# Altium schematic sheet 14 Exp Conn.SchDoc
size 420 x 297 mm
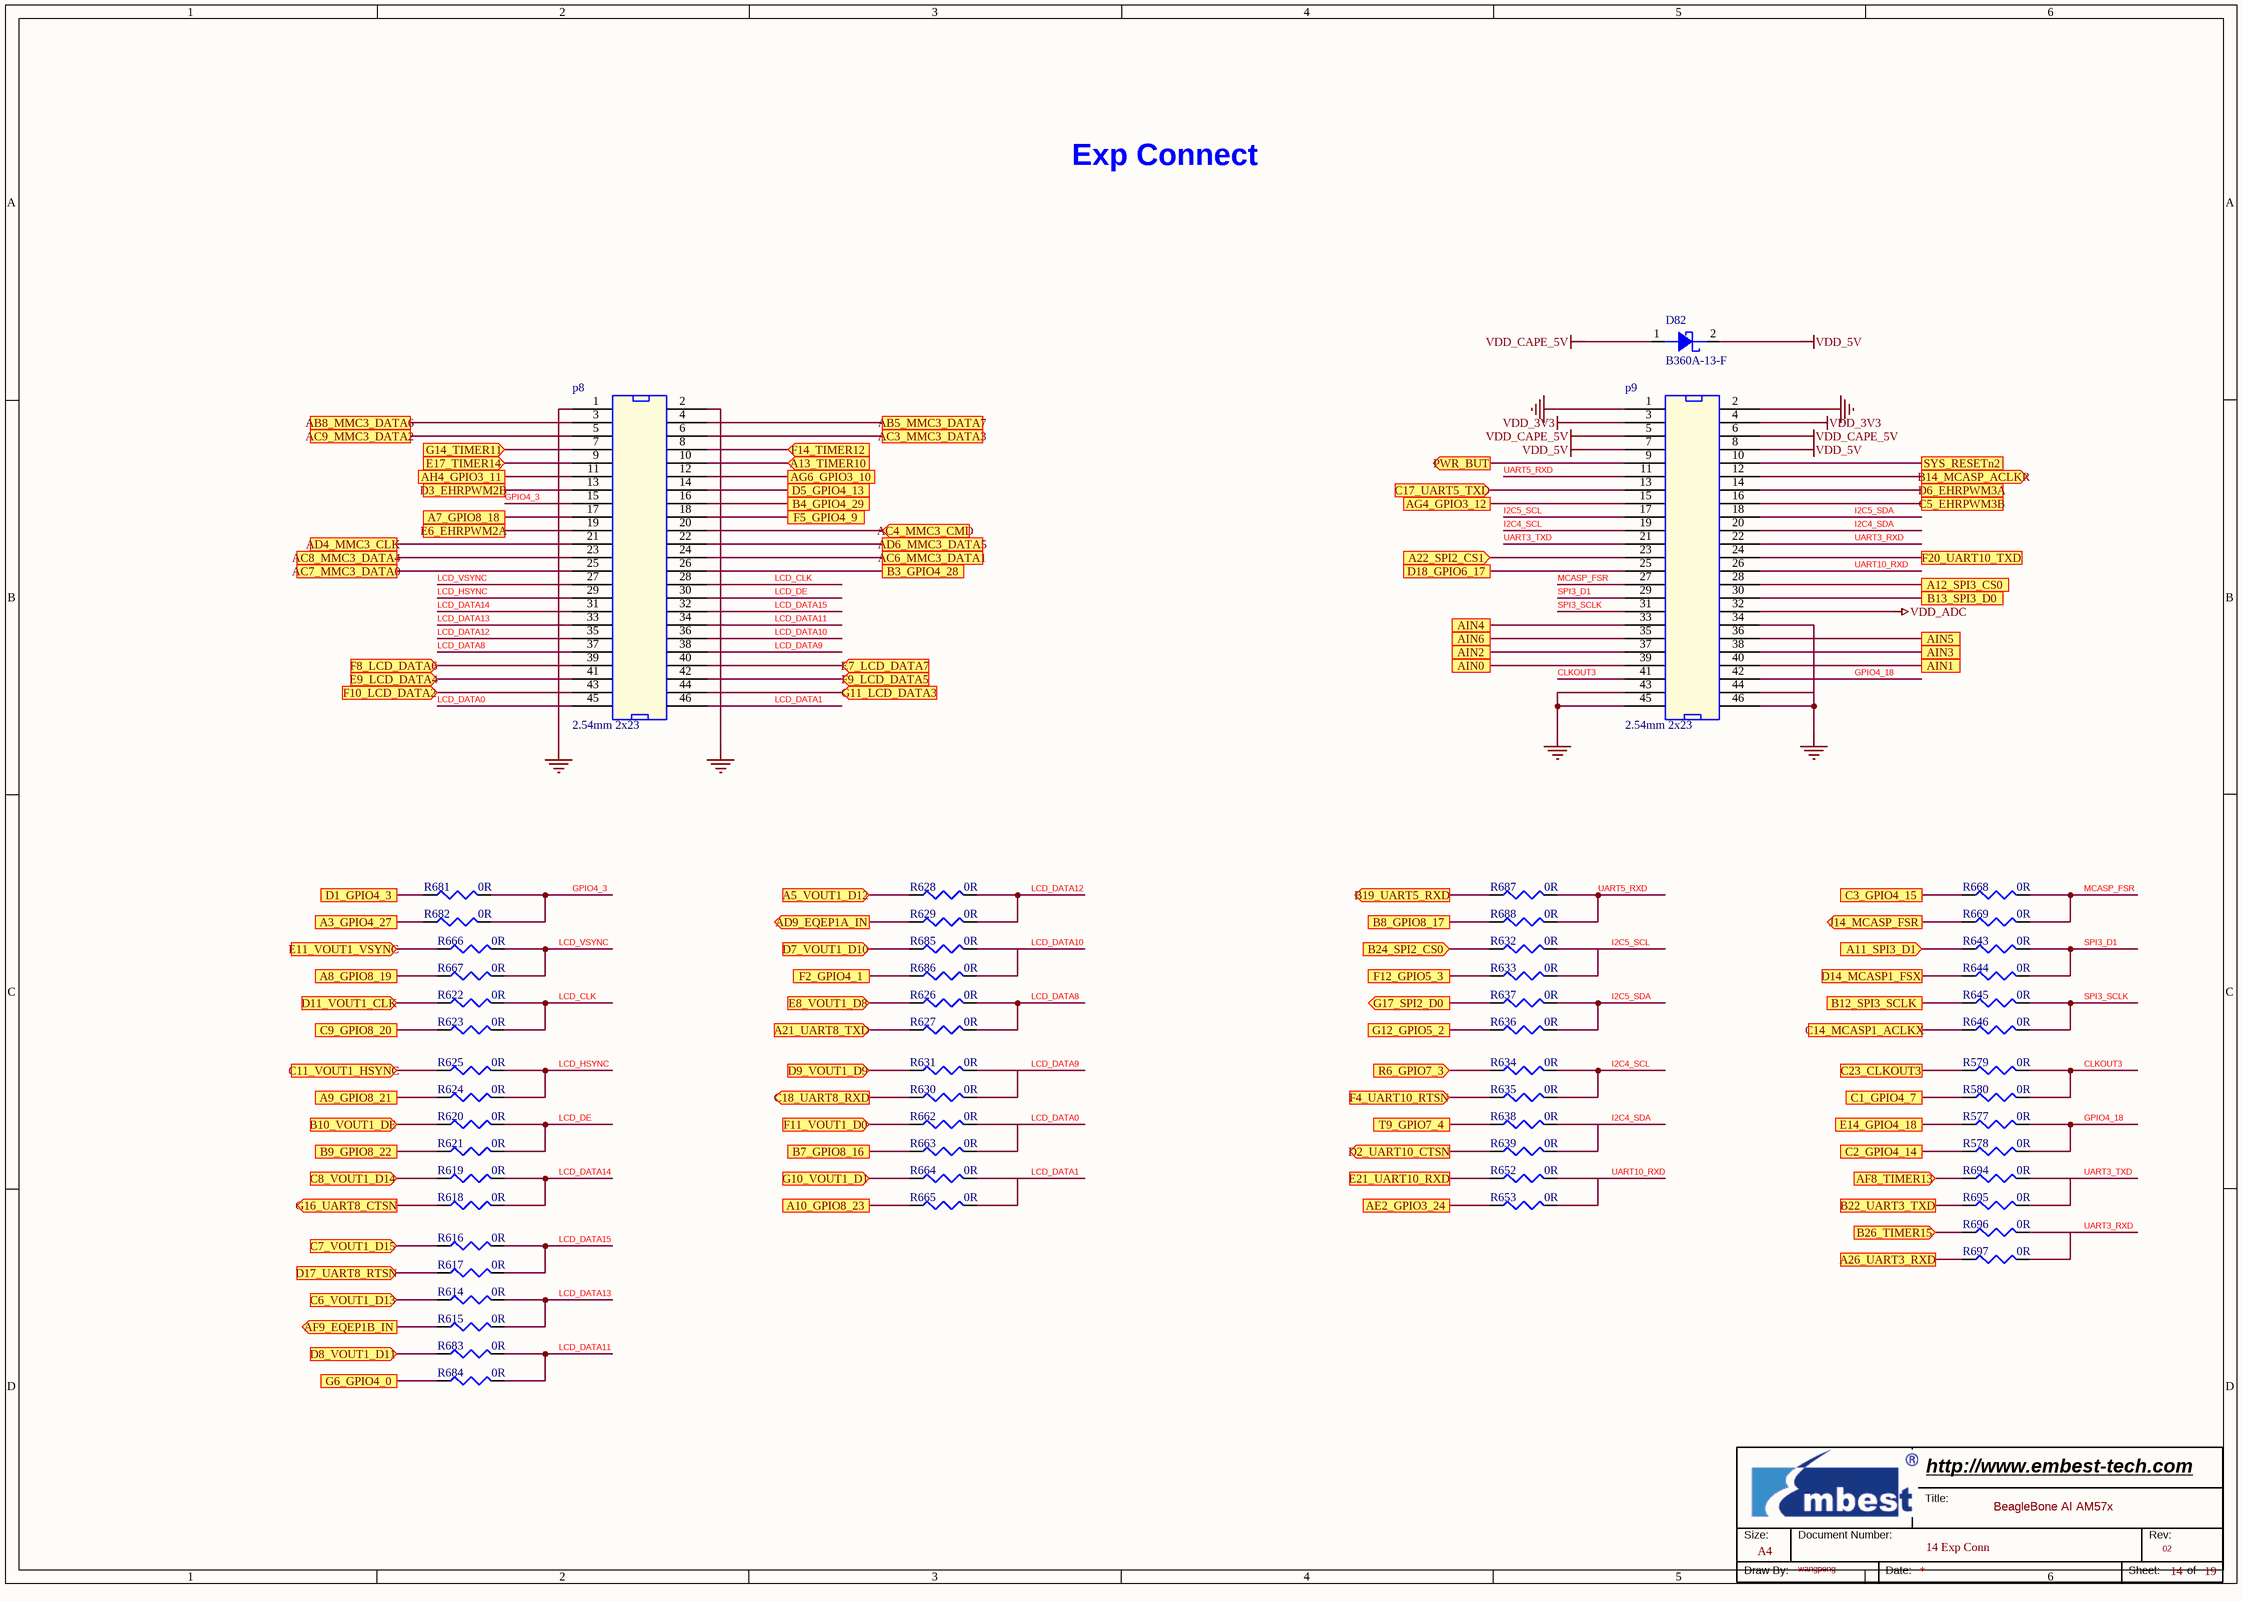
[diagram p0: 14 Exp Conn.SchDoc]

## Parts
*  Page Count: 19  Page Number: 14  Page Size: A4  Title: BeagleBone AI AM57x  RevCode: 02  Doc: 14 Exp Conn  Drawing: wangpeng  (hidden comment: Embest Title)  (graphical)
D82  B360A-13-F  [D_SMA]
p8  2.54mm 2x23  [h2x23mz]
p9  2.54mm 2x23  [h2x23mz]
R577  0R  [R0402]
R578  0R  [R0402]
R579  0R  [R0402]
R580  0R  [R0402]
R614  0R  [R0402]
R615  0R  [R0402]
R616  0R  [R0402]
R617  0R  [R0402]
R618  0R  [R0402]
R619  0R  [R0402]
R620  0R  [R0402]
R621  0R  [R0402]
R622  0R  [R0402]
R623  0R  [R0402]
R624  0R  [R0402]
R625  0R  [R0402]
R626  0R  [R0402]
R627  0R  [R0402]
R628  0R  [R0402]
R629  0R  [R0402]
R630  0R  [R0402]
R631  0R  [R0402]
R632  0R  [R0402]
R633  0R  [R0402]
R634  0R  [R0402]
R635  0R  [R0402]
R636  0R  [R0402]
R637  0R  [R0402]
R638  0R  [R0402]
R639  0R  [R0402]
R643  0R  [R0402]
R644  0R  [R0402]
R645  0R  [R0402]
R646  0R  [R0402]
R652  0R  [R0402]
R653  0R  [R0402]
R662  0R  [R0402]
R663  0R  [R0402]
R664  0R  [R0402]
R665  0R  [R0402]
R666  0R  [R0402]
R667  0R  [R0402]
R668  0R  [R0402]
R669  0R  [R0402]
R681  0R  [R0402]
R682  0R  [R0402]
R683  0R  [R0402]
R684  0R  [R0402]
R685  0R  [R0402]
R686  0R  [R0402]
R687  0R  [R0402]
R688  0R  [R0402]
R694  0R  [R0402]
R695  0R  [R0402]
R696  0R  [R0402]
R697  0R  [R0402]

## Ports
A3_GPIO4_27, A5_VOUT1_D12 (in), A7_GPIO8_18, A8_GPIO8_19, A9_GPIO8_21, A10_GPIO8_23, A11_SPI3_D1 (in), A12_SPI3_CS0, A13_TIMER10 (in), A21_UART8_TXD (in), A22_SPI2_CS1 (in), A26_UART3_RXD, AB5_MMC3_DATA7, AB8_MMC3_DATA6, AC3_MMC3_DATA3, AC4_MMC3_CMD (in), AC6_MMC3_DATA1, AC7_MMC3_DATA0, AC8_MMC3_DATA4, AC9_MMC3_DATA2, AD4_MMC3_CLK, AD6_MMC3_DATA5, AD9_EQEP1A_IN (out), AE2_GPIO3_24, AF8_TIMER13 (in), AF9_EQEP1B_IN (out), AG4_GPIO3_12, AG6_GPIO3_10, AH4_GPIO3_11, AIN0, AIN1, AIN2, AIN3, AIN4, AIN5, AIN6, B3_GPIO4_28, B4_GPIO4_29, B7_GPIO8_16, B8_GPIO8_17, B9_GPIO8_22, B10_VOUT1_DE (in), B12_SPI3_SCLK, B13_SPI3_D0, B14_MCASP_ACLKR (out), B19_UART5_RXD (out), B22_UART3_TXD, B24_SPI2_CS0 (in), B26_TIMER15 (in), C1_GPIO4_7, C2_GPIO4_14, C3_GPIO4_15, C5_EHRPWM3B, C6_VOUT1_D13 (in), C7_VOUT1_D15 (in), C8_VOUT1_D14 (in), C9_GPIO8_20, C11_VOUT1_HSYNC (in), C14_MCASP1_ACLKX, C17_UART5_TXD (in), C18_UART8_RXD (out), C23_CLKOUT3, D1_GPIO4_3, D2_UART10_CTSN (out), D3_EHRPWM2B, D5_GPIO4_13, D6_EHRPWM3A, D7_VOUT1_D10 (in), D8_VOUT1_D11 (in), D9_VOUT1_D9 (in), D11_VOUT1_CLK (in), D14_MCASP1_FSX, D17_UART8_RTSN (in), D18_GPIO6_17, E6_EHRPWM2A, E7_LCD_DATA7 (in), E8_VOUT1_D8 (in), E9_LCD_DATA4 (in), E11_VOUT1_VSYNC (in), E14_GPIO4_18, E17_TIMER14 (in), E21_UART10_RXD, F2_GPIO4_1, F4_UART10_RTSN (in), F5_GPIO4_9, F8_LCD_DATA6 (in), F9_LCD_DATA5 (in), F10_LCD_DATA2 (in), F11_VOUT1_D0 (in), F12_GPIO5_3, F14_TIMER12 (in), F20_UART10_TXD, G6_GPIO4_0, G10_VOUT1_D1 (in), G11_LCD_DATA3 (in), G12_GPIO5_2, G14_TIMER11 (in), G16_UART8_CTSN (out), G17_SPI2_D0 (out), J14_MCASP_FSR (out), PWR_BUT (out), R6_GPIO7_3 (in), SYS_RESETn2, T9_GPIO7_4

## Nets
GND: p8.1 p8.2 p9.1 p9.2 p9.34 p9.43 p9.44 p9.45 p9.46
VDD_3V3: p9.3 p9.4
VDD_5V: D82.2(C) p9.7 p9.8
VDD_ADC: p9.32
VDD_CAPE_5V: D82.1(A) p9.5 p9.6
A3_GPIO4_27: R682.1 ; port A3_GPIO4_27
A5_VOUT1_D12: R628.1 ; port A5_VOUT1_D12
A7_GPIO8_18: p8.17 ; port A7_GPIO8_18
A8_GPIO8_19: R667.1 ; port A8_GPIO8_19
A9_GPIO8_21: R624.2 ; port A9_GPIO8_21
A10_GPIO8_23: R665.1 ; port A10_GPIO8_23
A11_SPI3_D1: R643.1 ; port A11_SPI3_D1
A12_SPI3_CS0: p9.28 ; port A12_SPI3_CS0
A13_TIMER10: p8.10 ; port A13_TIMER10
A21_UART8_TXD: R627.1 ; port A21_UART8_TXD
A22_SPI2_CS1: p9.23 ; port A22_SPI2_CS1
A26_UART3_RXD: R697.1 ; port A26_UART3_RXD
AB5_MMC3_DATA7: p8.4 ; port AB5_MMC3_DATA7
AB8_MMC3_DATA6: p8.3 ; port AB8_MMC3_DATA6
AC3_MMC3_DATA3: p8.6 ; port AC3_MMC3_DATA3
AC4_MMC3_CMD: p8.20 ; port AC4_MMC3_CMD
AC6_MMC3_DATA1: p8.24 ; port AC6_MMC3_DATA1
AC7_MMC3_DATA0: p8.25 ; port AC7_MMC3_DATA0
AC8_MMC3_DATA4: p8.23 ; port AC8_MMC3_DATA4
AC9_MMC3_DATA2: p8.5 ; port AC9_MMC3_DATA2
AD4_MMC3_CLK: p8.21 ; port AD4_MMC3_CLK
AD6_MMC3_DATA5: p8.22 ; port AD6_MMC3_DATA5
AD9_EQEP1A_IN: R629.1 ; port AD9_EQEP1A_IN
AE2_GPIO3_24: R653.1 ; port AE2_GPIO3_24
AF8_TIMER13: R694.1 ; port AF8_TIMER13
AF9_EQEP1B_IN: R615.1 ; port AF9_EQEP1B_IN
AG4_GPIO3_12: p9.15 ; port AG4_GPIO3_12
AG6_GPIO3_10: p8.12 ; port AG6_GPIO3_10
AH4_GPIO3_11: p8.11 ; port AH4_GPIO3_11
AIN0: p9.39 ; port AIN0
AIN1: p9.40 ; port AIN1
AIN2: p9.37 ; port AIN2
AIN3: p9.38 ; port AIN3
AIN4: p9.33 ; port AIN4
AIN5: p9.36 ; port AIN5
AIN6: p9.35 ; port AIN6
B3_GPIO4_28: p8.26 ; port B3_GPIO4_28
B4_GPIO4_29: p8.16 ; port B4_GPIO4_29
B7_GPIO8_16: R663.1 ; port B7_GPIO8_16
B8_GPIO8_17: R688.1 ; port B8_GPIO8_17
B9_GPIO8_22: R621.1 ; port B9_GPIO8_22
B10_VOUT1_DE: R620.1 ; port B10_VOUT1_DE
B12_SPI3_SCLK: R645.1 ; port B12_SPI3_SCLK
B13_SPI3_D0: p9.30 ; port B13_SPI3_D0
B14_MCASP_ACLKR: p9.12 ; port B14_MCASP_ACLKR
B19_UART5_RXD: R687.1 ; port B19_UART5_RXD
B22_UART3_TXD: R695.1 ; port B22_UART3_TXD
B24_SPI2_CS0: R632.1 ; port B24_SPI2_CS0
B26_TIMER15: R696.1 ; port B26_TIMER15
C1_GPIO4_7: R580.2 ; port C1_GPIO4_7
C2_GPIO4_14: R578.1 ; port C2_GPIO4_14
C3_GPIO4_15: R668.1 ; port C3_GPIO4_15
C5_EHRPWM3B: p9.16 ; port C5_EHRPWM3B
C6_VOUT1_D13: R614.1 ; port C6_VOUT1_D13
C7_VOUT1_D15: R616.1 ; port C7_VOUT1_D15
C8_VOUT1_D14: R619.1 ; port C8_VOUT1_D14
C9_GPIO8_20: R623.1 ; port C9_GPIO8_20
C11_VOUT1_HSYNC: R625.1 ; port C11_VOUT1_HSYNC
C14_MCASP1_ACLKX: R646.1 ; port C14_MCASP1_ACLKX
C17_UART5_TXD: p9.13 ; port C17_UART5_TXD
C18_UART8_RXD: R630.2 ; port C18_UART8_RXD
C23_CLKOUT3: R579.1 ; port C23_CLKOUT3
CLKOUT3: p9.41 R579.2 R580.1
D1_GPIO4_3: R681.1 ; port D1_GPIO4_3
D2_UART10_CTSN: R639.1 ; port D2_UART10_CTSN
D3_EHRPWM2B: p8.13 ; port D3_EHRPWM2B
D5_GPIO4_13: p8.14 ; port D5_GPIO4_13
D6_EHRPWM3A: p9.14 ; port D6_EHRPWM3A
D7_VOUT1_D10: R685.1 ; port D7_VOUT1_D10
D8_VOUT1_D11: R683.1 ; port D8_VOUT1_D11
D9_VOUT1_D9: R631.1 ; port D9_VOUT1_D9
D11_VOUT1_CLK: R622.1 ; port D11_VOUT1_CLK
D14_MCASP1_FSX: R644.1 ; port D14_MCASP1_FSX
D17_UART8_RTSN: R617.1 ; port D17_UART8_RTSN
D18_GPIO6_17: p9.25 ; port D18_GPIO6_17
E6_EHRPWM2A: p8.19 ; port E6_EHRPWM2A
E7_LCD_DATA7: p8.40 ; port E7_LCD_DATA7
E8_VOUT1_D8: R626.1 ; port E8_VOUT1_D8
E9_LCD_DATA4: p8.41 ; port E9_LCD_DATA4
E11_VOUT1_VSYNC: R666.1 ; port E11_VOUT1_VSYNC
E14_GPIO4_18: R577.1 ; port E14_GPIO4_18
E17_TIMER14: p8.9 ; port E17_TIMER14
E21_UART10_RXD: R652.1 ; port E21_UART10_RXD
F2_GPIO4_1: R686.1 ; port F2_GPIO4_1
F4_UART10_RTSN: R635.1 ; port F4_UART10_RTSN
F5_GPIO4_9: p8.18 ; port F5_GPIO4_9
F8_LCD_DATA6: p8.39 ; port F8_LCD_DATA6
F9_LCD_DATA5: p8.42 ; port F9_LCD_DATA5
F10_LCD_DATA2: p8.43 ; port F10_LCD_DATA2
F11_VOUT1_D0: R662.1 ; port F11_VOUT1_D0
F12_GPIO5_3: R633.1 ; port F12_GPIO5_3
F14_TIMER12: p8.8 ; port F14_TIMER12
F20_UART10_TXD: p9.24 ; port F20_UART10_TXD
G6_GPIO4_0: R684.1 ; port G6_GPIO4_0
G10_VOUT1_D1: R664.1 ; port G10_VOUT1_D1
G11_LCD_DATA3: p8.44 ; port G11_LCD_DATA3
G12_GPIO5_2: R636.2 ; port G12_GPIO5_2
G14_TIMER11: p8.7 ; port G14_TIMER11
G16_UART8_CTSN: R618.2 ; port G16_UART8_CTSN
G17_SPI2_D0: R637.1 ; port G17_SPI2_D0
GPIO4_3: p8.15 R681.2 R682.2
GPIO4_18: p9.42 R577.2 R578.2
I2C4_SCL: p9.19 R634.2 R635.2
I2C4_SDA: p9.20 R638.2 R639.2
I2C5_SCL: p9.17 R632.2 R633.2
I2C5_SDA: p9.18 R636.1 R637.2
J14_MCASP_FSR: R669.1 ; port J14_MCASP_FSR
LCD_CLK: p8.28 R622.2 R623.2
LCD_DATA0: p8.45 R662.2 R663.2
LCD_DATA1: p8.46 R664.2 R665.2
LCD_DATA8: p8.37 R626.2 R627.2
LCD_DATA9: p8.38 R630.1 R631.2
LCD_DATA10: p8.36 R685.2 R686.2
LCD_DATA11: p8.34 R683.2 R684.2
LCD_DATA12: p8.35 R628.2 R629.2
LCD_DATA13: p8.33 R614.2 R615.2
LCD_DATA14: p8.31 R618.1 R619.2
LCD_DATA15: p8.32 R616.2 R617.2
LCD_DE: p8.30 R620.2 R621.2
LCD_HSYNC: p8.29 R624.1 R625.2
LCD_VSYNC: p8.27 R666.2 R667.2
MCASP_FSR: p9.27 R668.2 R669.2
PWR_BUT: p9.9 ; port PWR_BUT
R6_GPIO7_3: R634.1 ; port R6_GPIO7_3
SPI3_D1: p9.29 R643.2 R644.2
SPI3_SCLK: p9.31 R645.2 R646.2
SYS_RESETn2: p9.10 ; port SYS_RESETn2
T9_GPIO7_4: R638.1 ; port T9_GPIO7_4
UART3_RXD: p9.22 R696.2 R697.2
UART3_TXD: p9.21 R694.2 R695.2
UART5_RXD: p9.11 R687.2 R688.2
UART10_RXD: p9.26 R652.2 R653.2

## Notes on the sheet
- Exp Connect
- (in symbol Embest Title) Title:; Size:; Document Number:; Rev:; Draw By:; Date:; Sheet:; of

## Library data of the parts
D82 = Diode Schottky: Diode,Schottky Diode,B360A-13-F,60V,3A,SMA,SMD; Manufacturer: DIODES; Embest PN: 1006002100006; Datasheet: Y:\ÐÂK3ÏµÍ³ÎïÁÏdatasheet\[1006002~013]diodes-transistors ¶þÈý¼«¹Ü\1006002100006 B360A-13-F diodes.pdf; Manufacturer Part Number: B360A-13-F; Part Type: Diode
p8 = HEAD2X23: Connector,Pin Socket,Straight,Female,2x23Pin,2.54MM pitch,8.5,3.0,Gold Flash 1u, black,DIP; Manufacturer: MTCONN; Manufacturer Part Number: JT254F-D180-850-223-001-G; Embest PN: 1009002200073; Part Type: Pin Socket; Status: BB-Black(AM437x)
p9 = HEAD2X23: Connector,Pin Socket,Straight,Female,2x23Pin,2.54MM pitch,8.5,3.0,Gold Flash 1u, black,DIP; Manufacturer Part Number: JT254F-D180-850-223-001-G; Manufacturer: MTCONN; Embest PN: 1009002200073; Status: BB-Black(AM437x); Part Type: Pin Socket
R577 R578 R618 R619 R626 R627 R632-R635 R643-R646 R663 R664 R667 R668 R681 R683 R685 R687 R688 = R: RES,0R,+/-5%,1/16W,SMD0402; Manufacturer: YAGEO; Manufacturer Part Number: RC0402JR-070RL; Embest PN: 1003001100001; Part Type: Thick film Resistor
R579 R580 R614-R617 R620-R625 R628-R631 R636-R639 R652 R653 R662 R665 R666 R669 R682 R684 R686 R694-R697 = R: RES,0R,+/-5%,1/16W,SMD0402; Manufacturer Part Number: RC0402JR-070RL; Manufacturer: YAGEO; Embest PN: 1003001100001; Part Type: Thick film Resistor
* = Embest Title: Page Create Date: May 29, 2006; WebSite: http://www.embest-tech.com; Company: Embest; Page Modify Date: *